# Altium schematic sheet Microcontrollers.SchDoc
size A4; SheetNumber: 1; SheetTotal: 4
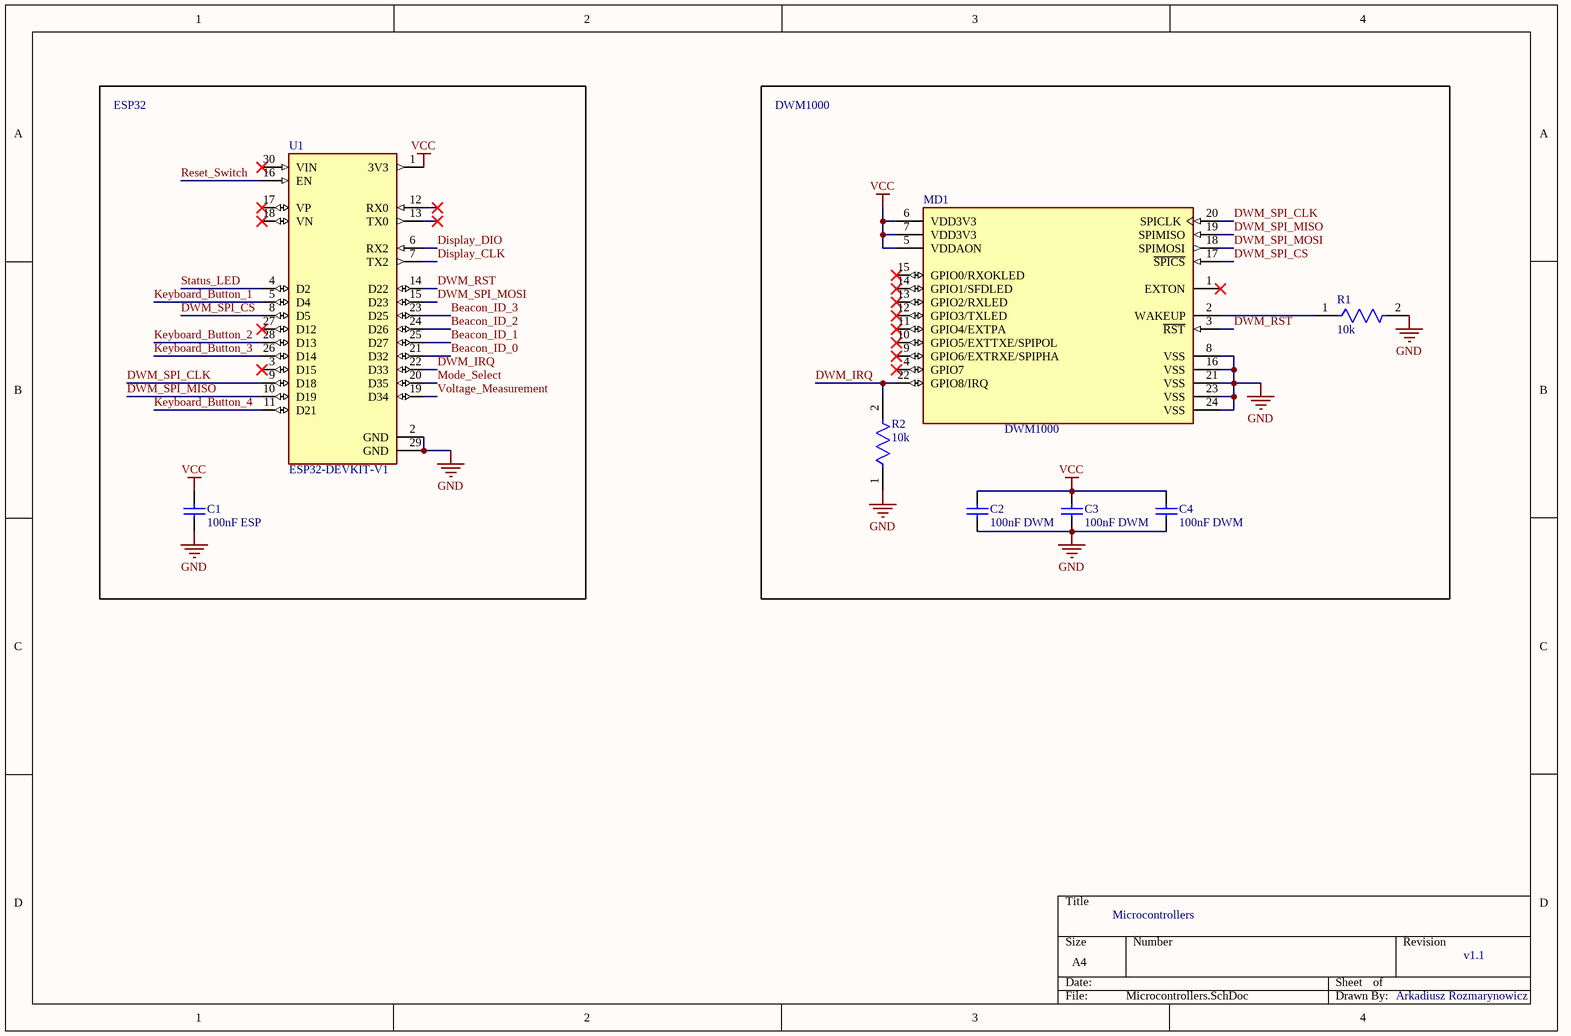
[diagram p0: Microcontrollers.SchDoc]

## Parts
C1  100nF ESP  [CAPC2013X145X48NL20T23]
C2  100nF DWM  [CAPC2013X145X48NL20T23]
C3  100nF DWM  [CAPC2013X145X48NL20T23]
C4  100nF DWM  [CAPC2013X145X48NL20T23]
MD1  DWM1000  [FP-DWM1000-MFG]
R1  10k  [FP-CRGCQ0805-IPC_C]
R2  10k  [FP-CRGCQ0805-IPC_C]
U1  ESP32-DEVKIT-V1  [MODULE_ESP32_DEVKIT_V1]

## Blocks framed on the sheet
ESP32: C1 U1
DWM1000: C2-C4 MD1 R1 R2

## Nets
GND: C1.1 C2.1 C3.1 C4.1 MD1.8(VSS) MD1.16(VSS) MD1.21(VSS) MD1.23(VSS) MD1.24(VSS) R1.2 R2.1 U1.2(GND) U1.29(GND)
VCC: C1.2 C2.2 C3.2 C4.2 MD1.5(VDDAON) MD1.6(VDD3V3) MD1.7(VDD3V3) U1.1(3V3)
Beacon_ID_0: U1.21(D32)
Beacon_ID_1: U1.25(D27)
Beacon_ID_2: U1.24(D26)
Beacon_ID_3: U1.23(D25)
Display_CLK: U1.7(TX2)
Display_DIO: U1.6(RX2)
DWM_IRQ: MD1.22(GPIO8/IRQ) R2.2 U1.22(D33)
DWM_RST: MD1.3(~{RST}) U1.14(D22)
DWM_SPI_CLK: MD1.20(SPICLK) U1.9(D18)
DWM_SPI_CS: MD1.17(~{SPICS}) U1.8(D5)
DWM_SPI_MISO: MD1.19(SPIMISO) U1.10(D19)
DWM_SPI_MOSI: MD1.18(SPIMOSI) U1.15(D23)
Keyboard_Button_1: U1.5(D4)
Keyboard_Button_2: U1.28(D13)
Keyboard_Button_3: U1.26(D14)
Keyboard_Button_4: U1.11(D21)
Mode_Select: U1.20(D35)
Reset_Switch: U1.16(EN)
Status_LED: U1.4(D2)
Voltage_Measurement: U1.19(D34)
NetMD1_2: MD1.2(WAKEUP) R1.1

Not connected (* = marked no-connect by the designer): MD1 1(EXTON)* 4(GPIO7)* 9(GPIO6/EXTRXE/SPIPHA)* 10(GPIO5/EXTTXE/SPIPOL)* 11(GPIO4/EXTPA)* 12(GPIO3/TXLED)* 13(GPIO2/RXLED)* 14(GPIO1/SFDLED)* 15(GPIO0/RXOKLED)*; U1 3(D15)* 12(RX0)* 13(TX0)* 17(VP)* 18(VN)* 27(D12)* 30(VIN)*

## Notes on the sheet
- Microcontrollers
- v1.1
- Arkadiusz Rozmarynowicz

## Library data of the parts
C1-C4 = CMP-2007-01705-1: Part Number: VJ0805Y104KXAMR; Manufacturer: Vitramon
MD1 = CMP-231853-000001-1: RX TXRX MODULE 802.15.4 CHIP SMD
R1 R2 = CMP-03211-009742-1: CRGCQ0805 10KΩ 0.125W ±100ppm/°C 5% 150V; Manufacturer Part Number: CRGCQ0805J100K; Manufacturer: TE Connectivity; Tolerance: 0.05; Temperature Range High: +155°C; Resistance: 10k; Automotive Grade: Grade 1142; RoHS: TRUE; Package: CRGCQ0805; Octopart: https://octopart.com/crgcq0805j100k-te+connectivity-91018199; Device Class L1: Passive Components; Lead Free: Yes; Temperature: -55°C to +155°C; Category: Res; ComponentLink2Description: Datasheet; Power Rating: 0.125W; Ambient Temperature Range High: +70°C; Composition: Thick Film; Temperature Range Low: -55°C; Voltage Rating: 150V; Device Class L3: Chip SMD Resistors; Height: 0.65mm; Series: CRGCQ; Temperature Coefficient: ±100ppm/°C; Automotive: Yes; Device Class L2: Resistors; Ipc Land Pattern Name: RESC200125X55; ComponentLink2URL: https://www.te.com/commerce/DocumentDelivery/DDEController?Action=showdoc&DocId=Data+Sheet%7F1773204-3%7F1%7Fpdf%7FEnglish%7FENG_DS_1773204-3_1.pdf%7F4-2176341-1151; Value: 10k
U1 = ESP32-DEVKIT-V1: Dual core, Wi-Fi: 2.4 GHz up to 150 Mbits/s,BLE (Bluetooth Low Energy) and legacy Bluetooth, 32 bits, Up to 240 MHz; MF: Do it; SnapEDA_Link: https://www.snapeda.com/parts/ESP32-DEVKIT-V1/Do+it/view-part/?ref=snap; Package: None; Value: *; MP: ESP32-DEVKIT-V1; Check_prices: https://www.snapeda.com/parts/ESP32-DEVKIT-V1/Do+it/view-part/?ref=eda